# Altium schematic sheet USB.SchDoc: User USB Type-C
size A4; Date: Not used; ApprovedBy: Not used; CheckedBy: Not used; Author: Not used; CompanyName: STMicroelectronics; DrawnBy: Not used; Engineer: Not used; Organization: Not used; Address1: Not used; Address2: Not used; Address3: Not used; Address4: Not used; DocumentNumber: 8; Revision: Not used; SheetNumber: 8; SheetTotal: 9; CurrentTime: Not used; CurrentDate: Not used; Time: Not used; DocumentFullPathAndName: Not used; DocumentName: Not used; ModifiedDate: Not used; ImagePath: Not used; ProjectName: Not used; Application_BuildNumber: Not used
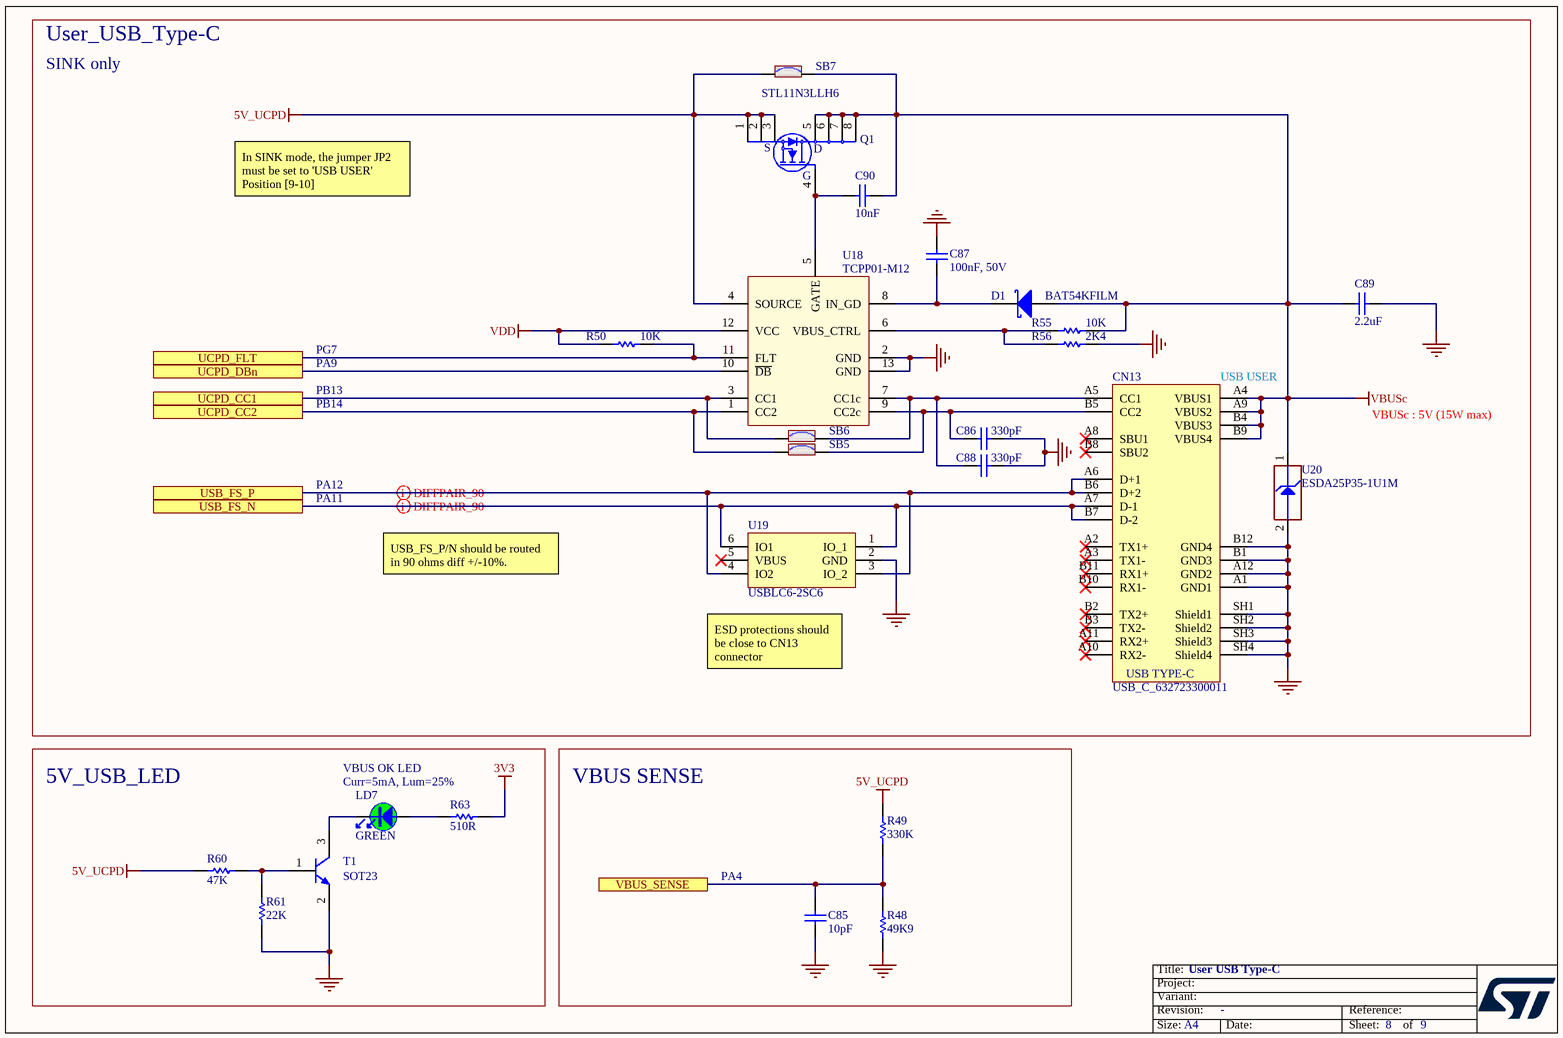
[diagram p0: USB.SchDoc]

## Parts
C85  value 10pF  [C0603]  (hidden comment: Capacitor)
C86  value 330pF  [C0402]  (hidden comment: Capacitor)
C87  value 100nF, 50V  [C0603]  (hidden comment: Capacitor)
C88  value 330pF  [C0402]  (hidden comment: Capacitor)
C89  value 2.2uF  [C0805]  (hidden comment: Capacitor)
C90  value 10nF  [C0402]  (hidden comment: Capacitor)
CN13  value USB_C_632723300011  [CON_USB-TYPEC_WE_632723300011]  (hidden comment: USB_TYPE_C_Receptacle)
D1  value BAT54KFILM  [DIO_SOD523_1A_2K]  (hidden comment: SCHOTTKY_1A_2K)
LD7  value GREEN  [LED_0603_OSRAM_LG-Q396-PS-35_GREEN_1A2K_H0P4]  (hidden comment: LED_green)
Q1  STL11N3LLH6  [MOS_POWERFLAT_3P3X3P3_P065]
R48  value 49K9  [R0603]  (hidden comment: Resistor)
R49  value 330K  [R0603]  (hidden comment: Resistor)
R50  value 10K  [R0402]  (hidden comment: Resistor)
R55  value 10K  [R0402]  (hidden comment: Resistor)
R56  value 2K4  [R0402]  (hidden comment: Resistor)
R60  value 47K  [R0603]  (hidden comment: Resistor)
R61  value 22K  [R0603]  (hidden comment: Resistor)
R63  value 510R  [R0603]  (hidden comment: Resistor)
SB5  SB_ON  [SOLDER-BRIDGE_R0402-0R]  (value not drawn)
SB6  SB_ON  [SOLDER-BRIDGE_R0402-0R]  (value not drawn)
SB7  SB_ON  [SOLDER-BRIDGE_R0402-0R]  (value not drawn)
T1  value SOT23  [NPN_SOT23]  (hidden comment: 9013-SOT23)
U18  TCPP01-M12  [ICC_QFN12L-EPAD_3X3_P050]
U19  USBLC6-2SC6  [ESD_SOT23-6L]
U20  value ESDA25P35-1U1M  [ESD_QFN1610_2N_1K_2A]  (hidden comment: ESD-TRANSIL)

## Blocks framed on the sheet
User_USB_Type-C: C86-C90 CN13 D1 Q1 R50 R55 R56 SB5-SB7 U18-U20
5V_USB_LED: LD7 R60 R61 R63 T1
VBUS SENSE: C85 R48 R49

## Ports
UCPD_CC1, UCPD_CC2, UCPD_DBn, UCPD_FLT, USB_FS_N, USB_FS_P, VBUS_SENSE

## Nets
3V3: R63.2
5V_UCPD: Q1.1(S) Q1.2(S) Q1.3(S) R49.2 R60.1 SB7.1 U18.4(SOURCE)
GND: C85.1 C86.2 C87.2 C88.2 C89.2 CN13.A1(GND1) CN13.A12(GND2) CN13.B1(GND3) CN13.B12(GND4) CN13.SH1(Shield1) CN13.SH2(Shield2) CN13.SH3(Shield3) CN13.SH4(Shield4) R48.1 R56.2 R61.1 T1.2(E) U18.2(GND) U18.13(GND) U19.2(GND) U20.2(GND)
VBUSc: C89.1 C90.2 CN13.A4(VBUS1) CN13.A9(VBUS2) CN13.B4(VBUS3) CN13.B9(VBUS4) D1.1(A) Q1.5(D) Q1.6(D) Q1.7(D) Q1.8(D) R55.2 SB7.2 U20.1(IO1)
VDD: R50.1 U18.12(VCC)
UCPD_CC1: SB6.1 U18.3(CC1) ; port UCPD_CC1
UCPD_CC2: SB5.1 U18.1(CC2) ; port UCPD_CC2
UCPD_DBn: U18.10(~{DB}) ; port UCPD_DBn
UCPD_FLT: R50.2 U18.11(FLT) ; port UCPD_FLT
USB_FS_N: CN13.A7(D-1) CN13.B7(D-2) U19.1(IO_1) U19.6(IO1) ; port USB_FS_N
USB_FS_P: CN13.A6(D+1) CN13.B6(D+2) U19.3(IO_2) U19.4(IO2) ; port USB_FS_P
VBUS_SENSE: C85.2 R48.2 R49.1 ; port VBUS_SENSE
NetC86_1: C86.1 CN13.B5(CC2) SB5.2 U18.9(CC2c)
NetC87_1: C87.1 D1.2(K) U18.8(IN_GD)
NetC88_1: C88.1 CN13.A5(CC1) SB6.2 U18.7(CC1c)
NetC90_1: C90.1 Q1.4(G) U18.5(GATE)
NetLD7_1: LD7.1 R63.1
NetLD7_2: LD7.2 T1.3(C)
NetR55_1: R55.1 R56.1 U18.6(VBUS_CTRL)
NetR60_2: R60.2 R61.2 T1.1(B)

Not connected (* = marked no-connect by the designer): CN13 A2(TX1+)* A3(TX1-)* A8(SBU1)* A10(RX2-)* A11(RX2+)* B2(TX2+)* B3(TX2-)* B8(SBU2)* B10(RX1-)* B11(RX1+)*; U19 5(VBUS)*

## Layout directives
differential pair: USB_FS_N, USB_FS_P

## Notes on the sheet
- SINK only
- In SINK mode, the jumper JP2 must be set to 'USB USER' Position [9-10]
- PA9
- PG7
- (near CN13) USB USER
- PB14
- PB13
- VBUSc : 5V (15W max)
- PA11
- PA12
- USB_FS_P/N should be routed in 90 ohms diff +/-10%.
- (near U19) ESD protections should be close to CN13 connector
- VBUS OK LED
- Curr=5mA, Lum=25%
- PA4
- Title:
- Project:
- Size:
- Revision:
- Variant:
- A4
- -
- Date:
- Reference:
- Sheet:
- of
- (in symbol MCD-02273) USB TYPE-C

## Library data of the parts
C85 = MCD-00637: Capacitor, MLCC, 10pF, 50V, NPO, 5%, 0603, T=0,8mm; Manufacturer_Part_Number: CC0603JRNPO9BN100; Manufacturer: YAGEO; ECCN_US: EAR99; ECCN_EU: NEC; Provided_By: SUBCO; Internal_Part_Number: MCD-00637; Status: Released; Part_Type: Capacitor; Package: C0603; ComponentLink1Description: Datasheet; ComponentLink1URL: http://tunmcdsvn.tun.st.com/Component_Datasheet_Library/Trunk/Capacitors/Yageo_Capacitor_NP0_16V-to-50V
C86 C88 = MCD-01579: Capacitor, MLCC, 330pF, 50V, NPO, +/-5%, 0402, T=0,5mm; Part_Preference: Recommended; Manufacturer: YAGEO; Manufacturer_Part_Number: CC0402JRNPO9BN331; Internal_Part_Number: MCD-01579; Status: Checked; Part_Type: Capacitor; Package: C0402; ComponentLink1URL: http://tunmcdsvn.tun.st.com/Component_Datasheet_Library/Trunk/Capacitors/Yageo_Capacitor_NP0_16V-to-50V; Order_Code_Digikey: 311-1667-1-ND; Order_Code_Farnell: N/A; Order_Code_RS: N/A
C87 = MCD-01099: Capacitor,100nF,50V,X7R,10%,0603; Manufacturer_Part_Number: CC0603KRX7R9BB104; Manufacturer: YAGEO; BMS_Part_Number: 9142278; Provided_By: SUBCO; Internal_Part_Number: MCD-01099; Status: Released; Part_Type: Capacitor; Package: C0603; ComponentLink1Description: Datasheet; ComponentLink1URL: http://tunmcdsvn.tun.st.com/Component_Datasheet_Library/Trunk/Capacitors/Yageo_Multilayer_Capacitor_X7R_series_100pF_to_22uF/Yageo_Mutilayer_Capacitor_X7R_100pF_to_22uF.pdf; ECCN_US: N/A; ECCN_EU: N/A
C89 = MCD-02372: Capacitor, MLCC, 2.2uF, 25V, X7R, +/-10%, 0805, T=1,25mm; Part_Preference: Recommended; Manufacturer: MURATA; Manufacturer_Part_Number: GRM21BR71E225KE11L; Internal_Part_Number: MCD-02372; Status: New; Part_Type: Capacitor; Package: C0805; ComponentLink1URL: http://tunmcdsvn.tun.st.com/Component_Documentation_Library/Trunk/Capacitor/MURATA_GRM_Series/GRM21BR71E225KE11; Order_Code_Digikey: 490-14467; Order_Code_Farnell: 2688538
C90 = MCD-02198: Capacitor, MLCC, 10nF, 50V ,X7R, +/-10%, 0402, T=0.5mm; Part_Preference: Recommended; Manufacturer: YAGEO; Manufacturer_Part_Number: CC0402KRX7R9BB103; Alternate_Manufacturer: TAIYO YUDEN; Alternate_Manufacturer_Part_Number: UMF105B7103KVHF; Order_Code_RS: 6169644; Internal_Part_Number: MCD-02198; Status: Checked; Part_Type: Capacitor; Package: C0402; ComponentLink1URL: http://tunmcdsvn.tun.st.com/Component_Datasheet_Library/Trunk/Capacitors/Yageo_Multilayer_Capacitor_X7R_series_100pF_to_22uF/Yageo_Mutilayer_Capacitor_X7R_100pF_to_22uF.pdf; Order_Code_Digikey: N/A; Order_Code_Farnell: N/A
CN13 = MCD-02273: Connector_USB_TypeC, 24pins, RA, TH, T=1.9mm (USB certified); Part_Preference: Recommended; Manufacturer: WURTH ELEKTRONIK; Manufacturer_Part_Number: 632723300011; Component_Country_Of_Origin: China; ShowFields: YES; ID: 4373; Internal_Part_Number: MCD-02273; Status: Released; Part_Type: Connector; ComponentLink1URL: http://tunmcdsvn.tun.st.com/Component_Datasheet_Library/Trunk/Connectors/WURTH_ELEKTRONIK_USB_TYPE-C_632723300011; Order_Code_Digikey: 732-9618-1-ND; Order_Code_Farnell: 2984404; Order_Code_RS: N/A
D1 = MCD-01677: Small signal Schottky diodes; Part_Type: Diode; Manufacturer: STMICROELECTRONICS; BMS_Part_Number: 9151123; ECCN_US: EAR99; ECCN_EU: NEC; Provided_By: SUBCO; Internal_Part_Number: MCD-01677; Status: Checked; Manufacturer_Part_Number: BAT54KFILM; Package: SOD-523; ComponentLink1Description: Datasheet; ComponentLink1URL: http://tunmcdsvn.tun.st.com/Component_Datasheet_Library/Trunk/Diodes/STM_SCHOTTKY_DOUBLE_BAT54SWFILM/STM_SCHOTTKY_DOUBLE_BAT54SWFILM.pdf
LD7 = MCD-00588: LED Green, 0603 SMD, Forward Voltage Typ=2V, Max=2.5V; Part_Type: Display; Manufacturer_Part_Number: LG Q396-PS-35; Manufacturer: OSRAM OPTO SEMICONDUCTORS; Alternate_Manufacturer_Part_Number: VLMTG1300-GS08; Alternate_Manufacturer: VISHAY SEMICONDUCTOR OPTO DIVISION; Provided_By: SUBCO; Internal_Part_Number: MCD-00588; Status: Released; Package: LED 0603; ComponentLink1Description: Datasheet; ComponentLink1URL: http://tunmcdsvn.tun.st.com/Component_Datasheet_Library/Trunk/Display/OSRAM_LED_GREEN_LG Q396-PS-35; Order_Code_Digikey: LG Q396-PS-35-ND; ECCN_US: n/a; ECCN_EU: n/a
Q1 = MCD-01810: N-channel 30 V, 6 mΩ typ, 11 A STripFET™ H6, Power MOSFET in a PowerFLAT™ 3.3x3.3 package; Part_Type: IC; Manufacturer: STMICROELECTRONICS; BMS_Part_Number: 9153561; ECCN_US: EAR99; ECCN_EU: NEC; Provided_By: SUBCO with ST control; Internal_Part_Number: MCD-01810; Value: STL11N3LLH6; Status: Checked; Manufacturer_Part_Number: STL11N3LLH6; Package: PowerFLAT 3.3x3.3; ComponentLink1Description: Datasheet; ComponentLink1URL: http://tunmcdsvn.tun.st.com/Component_Datasheet_Library/Trunk/IC/STM_POWER_MOSFET_STL11N3LLH6
R48 = MCD-01171: Resistor,49K9,0603,1%; Manufacturer_Part_Number: RC0603FR-0749K9L; Manufacturer: YAGEO; ECCN_US: EAR99; ECCN_EU: NEC; Provided_By: SUBCO; Internal_Part_Number: MCD-01171; Status: Released; Part_Type: Resistor; Package: R0603; ComponentLink1Description: Datasheet; ComponentLink1URL: http://tunmcdsvn.tun.st.com/Component_Datasheet_Library/Trunk/Resistors/Yageo_Resistor_RC0603-series/
R49 = MCD-00458: Resistor,330K,0603,1%,1/10W; Manufacturer_Part_Number: RC0603FR-07330KL; Manufacturer: YAGEO; ECCN_US: EAR99; ECCN_EU: NEC; Provided_By: SUBCO; Internal_Part_Number: MCD-00458; Status: Released; Part_Type: Resistor; Package: R0603; ComponentLink1Description: Datasheet; ComponentLink1URL: http://tunmcdsvn.tun.st.com/Component_Datasheet_Library/Trunk/Resistors/Yageo_Resistor_RC0603-series
R50 R55 = MCD-00053: Resistor,10K,0402,1%,1/16W; BMS_Part_Number: 9131590; Part_Preference: Recommended; Manufacturer: YAGEO; Manufacturer_Part_Number: RC0402FR-0710KL; Internal_Part_Number: MCD-00053; Status: Released; Part_Type: Resistor; Package: R0402; ComponentLink1URL: http://tunmcdsvn.tun.st.com/Component_Datasheet_Library/Trunk/Resistors/Yageo_Resistor_RC0402-series; Order_Code_Digikey: 311-10.0KLRCT-ND; Order_Code_Farnell: 9239359; Order_Code_RS: N/A
R56 = MCD-00433: Resistor, 2K4, 0402, +/-1%, 1/16W; Part_Preference: Recommended; Manufacturer: YAGEO; Manufacturer_Part_Number: RC0402FR-072K4L; Internal_Part_Number: MCD-00433; Status: Released; Part_Type: Resistor; Alternate_Manufacturer: N/A; Alternate_Manufacturer_Part_Number: N/A; Package: 0402; ComponentLink1URL: http://tunmcdsvn.tun.st.com/Component_Documentation_Library/Trunk/Resistor/YAGEO_RC_L_Series; Order_Code_Digikey: 311-2.40KLRCT-ND; Order_Code_Farnell: 1458767; Order_Code_RS: N/A
R60 = MCD-00222: Resistor,47K,0603,1%,1/10W; Manufacturer_Part_Number: RC0603FR-0747KL; Manufacturer: YAGEO; ECCN_US: EAR99; ECCN_EU: NEC; Provided_By: SUBCO; Internal_Part_Number: MCD-00222; Status: Released; Part_Type: Resistor; Package: R0603; ComponentLink1Description: Datasheet; ComponentLink1URL: http://tunmcdsvn.tun.st.com/Component_Datasheet_Library/Trunk/Resistors/Yageo_Resistor_RC0603-series
R61 = MCD-00430: Resistor,22K,0603,1%,1/10W; Manufacturer_Part_Number: RC0603FR-0722KL; Manufacturer: YAGEO; ECCN_US: EAR99; ECCN_EU: NEC; Provided_By: SUBCO; Internal_Part_Number: MCD-00430; Status: Released; Part_Type: Resistor; Package: R0603; ComponentLink1Description: Datasheet; ComponentLink1URL: http://tunmcdsvn.tun.st.com/Component_Datasheet_Library/Trunk/Resistors/Yageo_Resistor_RC0603-series
R63 = MCD-00225: Resistor,510R,0603,1%,1/10W; Manufacturer_Part_Number: RC0603FR-07510RL; Manufacturer: YAGEO; ECCN_US: EAR99; ECCN_EU: NEC; Provided_By: SUBCO; Internal_Part_Number: MCD-00225; Status: Released; Part_Type: Resistor; Package: R0603; ComponentLink1Description: Datasheet; ComponentLink1URL: http://tunmcdsvn.tun.st.com/Component_Datasheet_Library/Trunk/Resistors/Yageo_Resistor_RC0603-series
SB5-SB7 = MCD-01618: Solder Bridge 0402 ON; Part_Type: Mechanical; Manufacturer_Part_Number: RC0402JR-070RL; Manufacturer: YAGEO; Provided_By: SUBCO; Internal_Part_Number: MCD-01618; Status: Footprint available; Package: SB0402; ComponentLink1Description: Datasheet; ComponentLink1URL: http://tunmcdsvn.tun.st.com/Component_Datasheet_Library/Trunk/Resistors/Yageo_Resistor_RC0402-series; ECCN_US: n/a; ECCN_EU: n/a
T1 = MCD-00073: NPN Bipolar Transistor; Manufacturer_Part_Number: BSR14; Manufacturer: ON SEMICONDUCTOR; Part_Type: IC; Alternate_Manufacturer_Part_Number: MMBT2222ALT1G / MMBT2222ALT3G; Provided_By: SUBCO; ECCN_US: EAR99; ECCN_EU: NEC; Revision: *; Internal_Part_Number: MCD-00073; ComponentLink1Description: Datasheet; Status: Released; ComponentLink1URL: http://tunmcdsvn.tun.st.com/Component_Datasheet_Library/Trunk/IC/NXP_Transistor_BSR14; Alternate_Manufacturer: ON SEMICONDUCTOR
U18 = MCD-01809: USB Type-C Port Protection for USB Power Delivery, PPS compliant; Part_Type: IC; Manufacturer: STMICROELECTRONICS; BMS_Part_Number: 9151145; ECCN_US: EAR99; ECCN_EU: NEC; Provided_By: SUBCO with ST control; Internal_Part_Number: MCD-01809; Value: TCPP01-M12; Status: Checked; Manufacturer_Part_Number: TCPP01-M12; Package: QFN-12L; ComponentLink1Description: Datasheet; ComponentLink1URL: http://tunmcdsvn.tun.st.com/Component_Datasheet_Library/Trunk/IC/STM_UCPD_Protection_TCPP01-M12
U19 = MCD-00163: Very low capacitance ESD protection; Part_Type: IC; Manufacturer: STMICROELECTRONICS; BMS_Part_Number: 9151075; Provided_By: SUBCO with ST control; ECCN_US: EAR99; ECCN_EU: NEC; Internal_Part_Number: MCD-00163; Value: USBLC6-2SC6; Status: Released; Manufacturer_Part_Number: USBLC6-2SC6; ComponentLink1Description: Datasheet; ComponentLink1URL: http://tunmcdsvn.tun.st.com/Component_Datasheet_Library/Trunk/Diodes/STM_ESD_USBLC6-2
U20 = MCD-01207: High power Transient voltage suppressor:25V/35A EOS and ESD transients protection.; Part_Type: Diode; Manufacturer: STMICROELECTRONICS; BMS_Part_Number: 9179045; ECCN_US: EAR99; ECCN_EU: NEC; Provided_By: SUBCO with ST control; Internal_Part_Number: MCD-01207; Status: Checked; Manufacturer_Part_Number: ESDA25P35-1U1M; Package: QFN1610; ComponentLink1Description: Datasheet; ComponentLink1URL: http://tunmcdsvn.tun.st.com/Component_Datasheet_Library/Trunk/Diodes/STM_ESD_ESDA25P35-1U1M